# EAGLE design Adafruit TCA9548A (EAGLE 6.4)
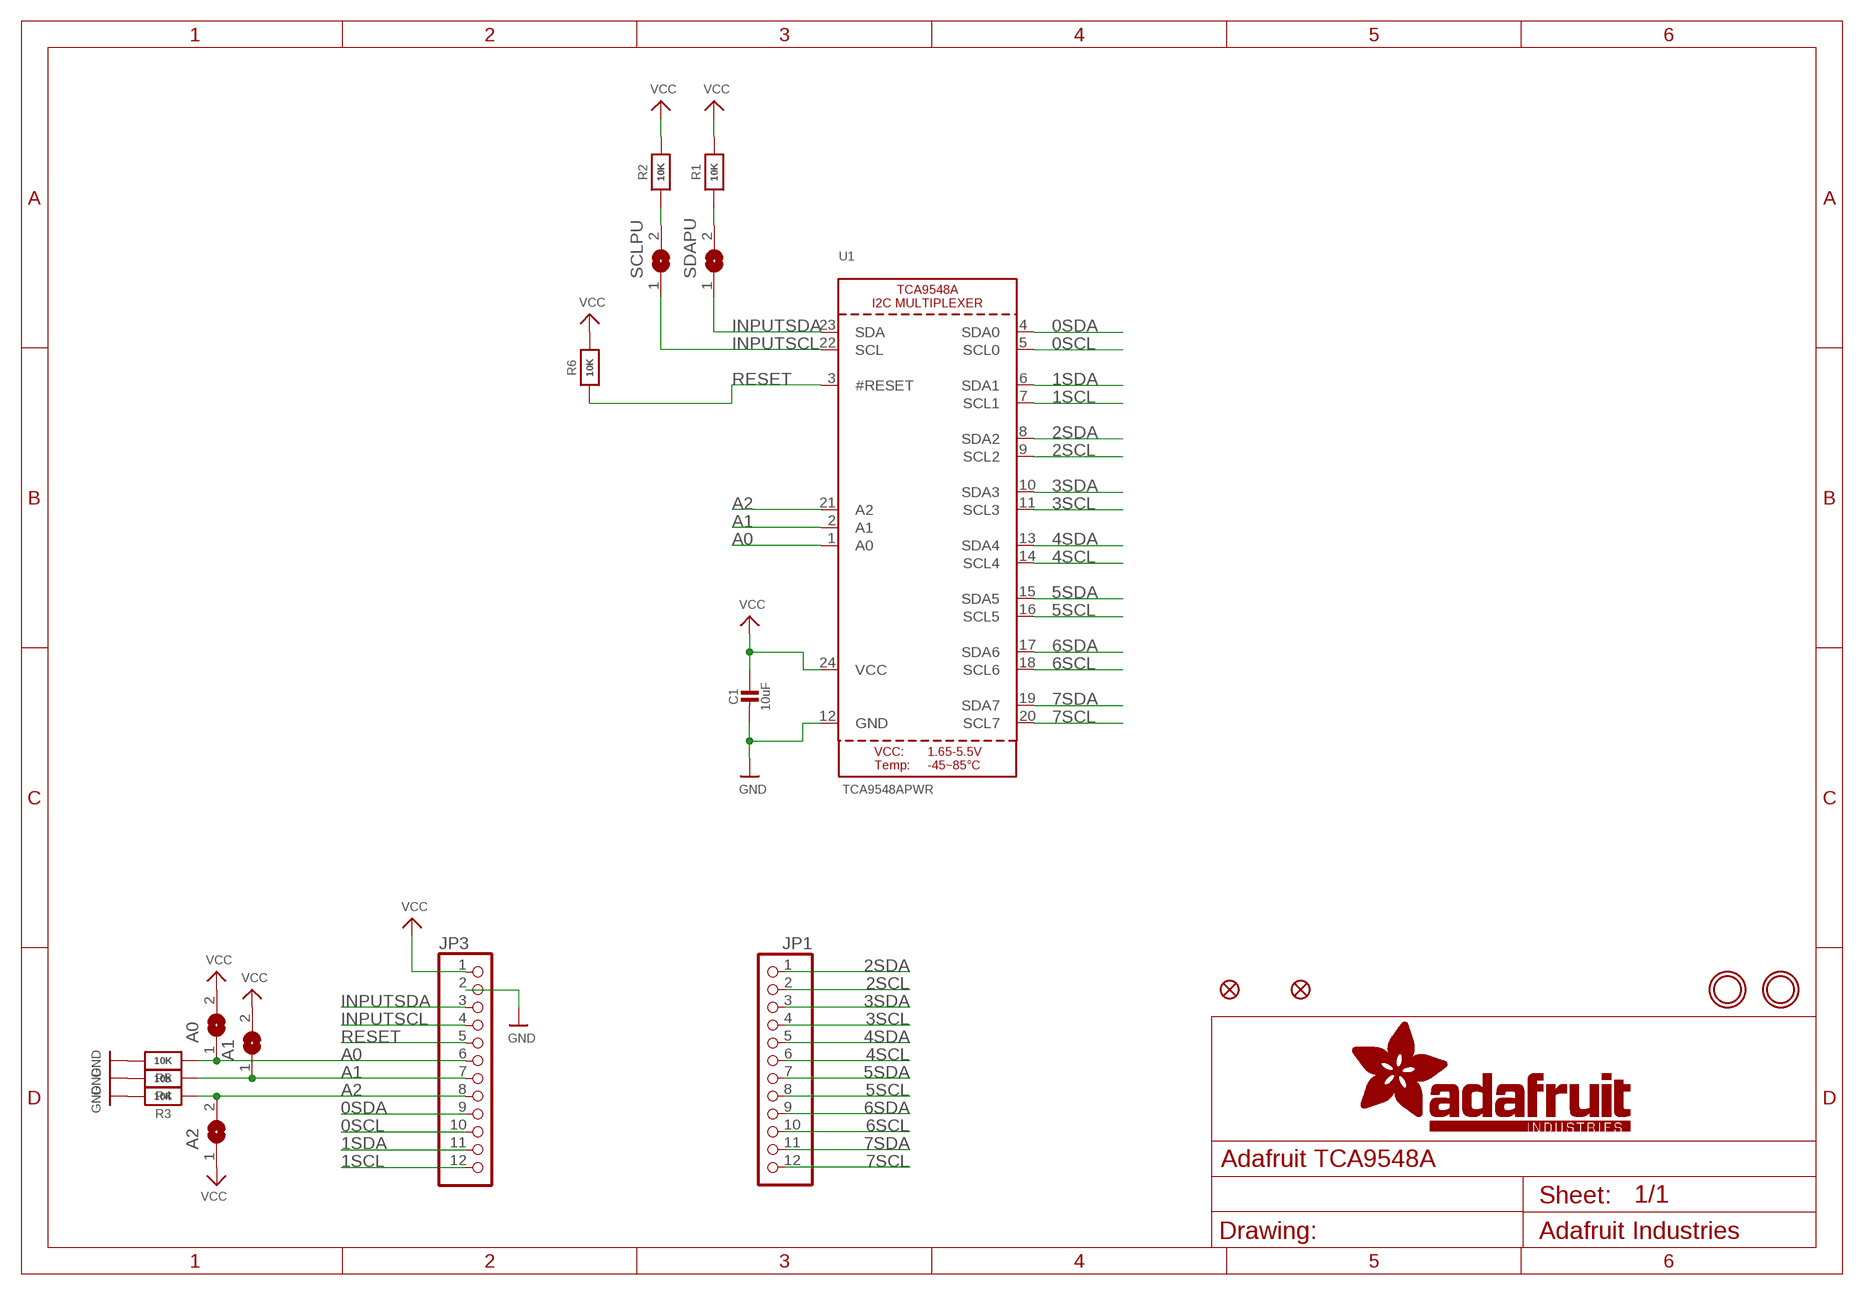
[diagram p0: schematic, sheet 1]

## Parts
A0  SOLDERJUMPER  [SOLDERJUMPER_ARROW_NOPASTE]
A1  SOLDERJUMPER  [SOLDERJUMPER_ARROW_NOPASTE]
A2  SOLDERJUMPER  [SOLDERJUMPER_ARROW_NOPASTE]
C1  10uF  CAP_CERAMIC0805-NOOUTLINE  [0805-NO]
FID1  FIDUCIAL""  [FIDUCIAL_1MM]
FID3  FIDUCIAL""  [FIDUCIAL_1MM]
JP1  HEADER-1X12  [1X12_ROUND]
JP3  HEADER-1X12  [1X12_ROUND]
R1  10K  RESISTOR0805_NOOUTLINE  [0805-NO]
R2  10K  RESISTOR0805_NOOUTLINE  [0805-NO]
R3  10K  RESISTOR0805_NOOUTLINE  [0805-NO]
R4  10K  RESISTOR0805_NOOUTLINE  [0805-NO]
R5  10K  RESISTOR0805_NOOUTLINE  [0805-NO]
R6  10K  RESISTOR_0805MP  [_0805MP]
SCLPU  SOLDERJUMPERCLOSED  [SOLDERJUMPER_CLOSEDWIRE]
SDAPU  SOLDERJUMPERCLOSED  [SOLDERJUMPER_CLOSEDWIRE]
U1  TCA9548APWR  TCA9548A  [TSSOP24]
U$4  MOUNTINGHOLE2.5  [MOUNTINGHOLE_2.5_PLATED]
U$5  MOUNTINGHOLE2.5  [MOUNTINGHOLE_2.5_PLATED]

## Nets
0SCL: JP3.10 U1.5(SCL0)
0SDA: JP3.9 U1.4(SDA0)
1SCL: JP3.12 U1.7(SCL1)
1SDA: JP3.11 U1.6(SDA1)
2SCL: JP1.2 U1.9(SCL2)
2SDA: JP1.1 U1.8(SDA2)
3SCL: JP1.4 U1.11(SCL3)
3SDA: JP1.3 U1.10(SDA3)
4SCL: JP1.6 U1.14(SCL4)
4SDA: JP1.5 U1.13(SDA4)
5SCL: JP1.8 U1.16(SCL5)
5SDA: JP1.7 U1.15(SDA5)
6SCL: JP1.10 U1.18(SCL6)
6SDA: JP1.9 U1.17(SDA6)
7SCL: JP1.12 U1.20(SCL7)
7SDA: JP1.11 U1.19(SDA7)
A0: A0.1 JP3.6 R5.1 U1.1(A0)
A1: A1.1 JP3.7 R4.1 U1.2(A1)
A2: A2.2 JP3.8 R3.1 U1.21(A2)
GND: C1.2 JP3.2 R3.2 R4.2 R5.2 U1.12(GND)
INPUTSCL: JP3.4 SCLPU.1 U1.22(SCL)
INPUTSDA: JP3.3 SDAPU.1 U1.23(SDA)
N$3: R2.1 SCLPU.2
N$4: R1.1 SDAPU.2
RESET: JP3.5 R6.1 U1.3(#RESET)
VCC: A0.2 A1.2 A2.1 C1.1 JP3.1 R1.2 R2.2 R6.2 U1.24(VCC)

## Library data of the parts
A0 A1 A2 = microbuilder:SOLDERJUMPER: SMD Solder JUMPER Solder the two pads together to create a connection, or remove the solder to break it. REFLOW - Use this footprint for solder paste and reflow ovens. WAVE - Use this footprint for hand-soldering (larger pads). CLOSED - Has a trace between the two pads to ensure it is closed by default. The trace needs to be cut to disable the jumper, and can be closed again by creating a solder bridge between the two pads.; BOM: EXCLUDE
C1 = microbuilder:CAP_CERAMIC: Ceramic Capacitors For new designs, use the packages preceded by an '_' character since they are more reliable: The following footprints should be used on most boards: _0402 - Standard footprint for regular board layouts _0603 - Standard footprint for regular board layouts _0805 - Standard footprint for regular board layouts _1206 - Standard footprint for regular board layouts For extremely tight-pitch boards where space is at a premium, the following 'micro-pitch' footprints can be used (smaller pads, no silkscreen outline, etc.): _0402MP - Micro-pitch footprint for very dense/compact boards _0603MP - Micro-pitch footprint for very dense/compact boards _0805MP - Micro-pitch footprint for very dense/compact boards _1206MP - Micro-pitch footprint for very dense/compact boards
FID1 FID3 = microbuilder:FIDUCIAL: Fiducial Alignment Points Various fiducial points for machine vision alignment.; BOM: EXCLUDE
JP1 JP3 = microbuilder:HEADER-1X12
R1-R6 = microbuilder:RESISTOR: Resistors For new designs, use the packages preceded by an '_' character since they are more reliable: The following footprints should be used on most boards: _0402 - Standard footprint for regular board layouts _0603 - Standard footprint for regular board layouts _0805 - Standard footprint for regular board layouts _1206 - Standard footprint for regular board layouts For extremely tight-pitch boards where space is at a premium, the following 'micro-pitch' footprints can be used (smaller pads, no silkscreen outline, etc.): _0402MP - Micro-pitch footprint for very dense/compact boards _0603MP - Micro-pitch footprint for very dense/compact boards _0805MP - Micro-pitch footprint for very dense/compact boards _1206MP - Micro-pitch footprint for very dense/compact boards
SCLPU SDAPU = microbuilder:SOLDERJUMPER: SMD Solder JUMPER Solder the two pads together to create a connection, or remove the solder to break it. REFLOW - Use this footprint for solder paste and reflow ovens. WAVE - Use this footprint for hand-soldering (larger pads). CLOSED - Has a trace between the two pads to ensure it is closed by default. The trace needs to be cut to disable the jumper, and can be closed again by creating a solder bridge between the two pads.
U1 = microbuilder:TCA9548A: TCA9548A I2C Multiplexer
U$4 U$5 = microbuilder:MOUNTINGHOLE: Mounting Hole For #2 screws (0.086"/2.18mm width, 0.094"/2.4mm hole) use 2.5mm; BOM: EXCLUDE

## Board
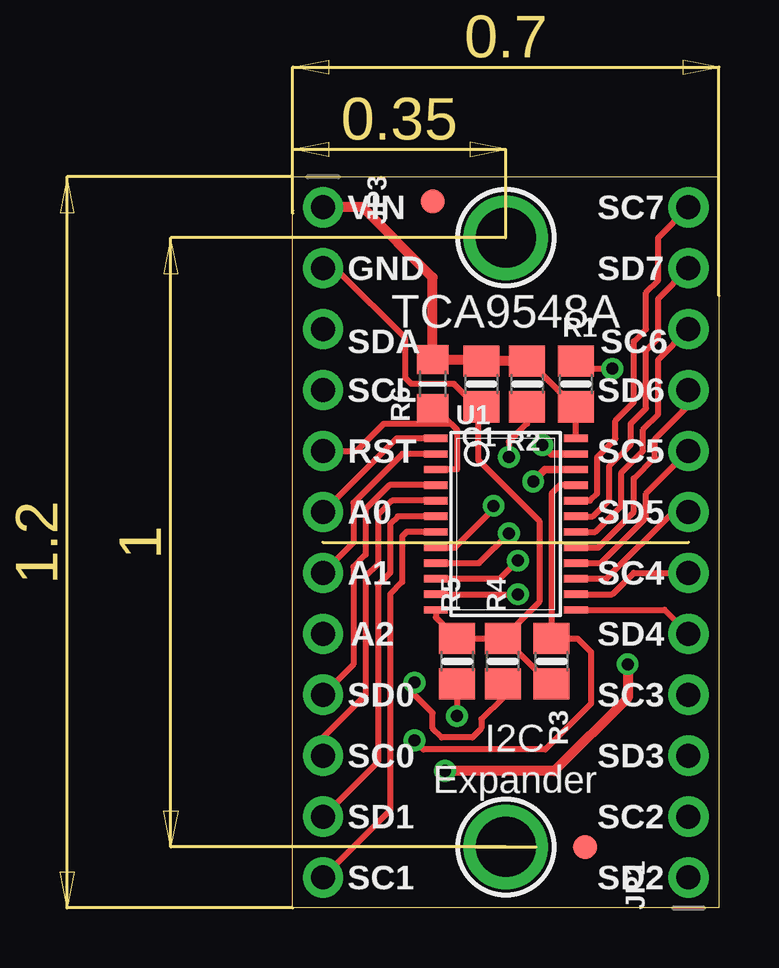
[diagram p1: board, top side]
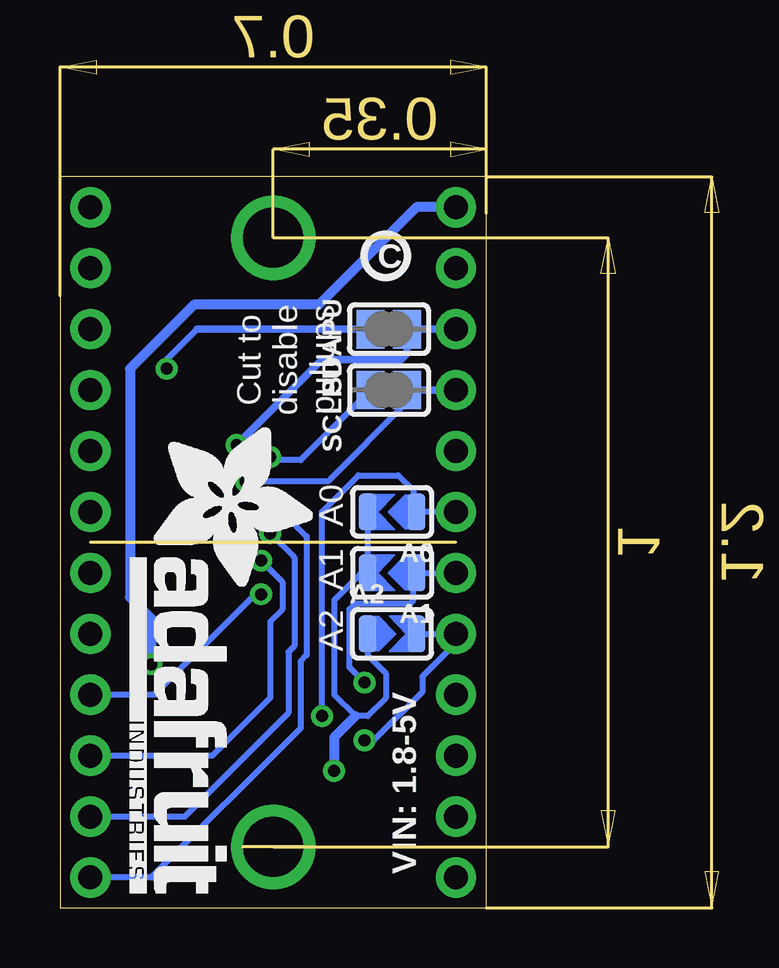
[diagram p2: board, bottom side, seen from below]

Size 17.78 x 30.48 mm. Coordinates in mm from the lower left corner, seen from the top.
Outline: 17.78,0 0,0 0,30.48 17.78,30.48 17.78,0
Copper layers (1*16): Top 0.035mm / dielectric 1.5mm / Bottom 0.035mm
Design rules "adafruit *": minimum track width 8mil, minimum drill 15.5mil, track to track 10mil, track to pad 10mil, pad to pad 10mil, via to via 10mil, smd to smd 8mil, copper to edge 10mil, drill to drill 8mil, minimum pad ring 10mil, minimum via ring 8mil, stop-mask expansion 2mil, vias tented up to drill 20mil, thermal gap 10mil

### Footprints (pad centres in the part's own frame; a part is rotated, then mirrored left to right if it is on the bottom)
SOLDERJUMPER_ARROW_NOPASTE = smd 0.762 x 1.524: 1 -1.016,0; 2 1.016,0
0805-NO = smd 1.3 x 1.5: 1 -0.95,0; 2 0.95,0
FIDUCIAL_1MM = smd 1 x 1: 1 0,0
1X12_ROUND = drill 1 pad 1.676: 1 -13.97,0; 2 -11.43,0; 3 -8.89,0; 4 -6.35,0; 5 -3.81,0; 6 -1.27,0; 7 1.27,0; 8 3.81,0; 9 6.35,0; 10 8.89,0; 11 11.43,0; 12 13.97,0
_0805MP = smd 1.2 x 1.3: 1 -1.016,0; 2 1.016,0
SOLDERJUMPER_CLOSEDWIRE = smd 1.168 x 1.6: 1 -0.762,0; 2 0.762,0 | smd 0.635 x 0.203: WIRE 0,0
TSSOP24 = smd 0.305 x 0.991: 1 -3.575,-2.918; 2 -2.925,-2.918; 3 -2.275,-2.918; 4 -1.625,-2.918; 5 -0.975,-2.918; 6 -0.325,-2.918; 7 0.325,-2.918; 8 0.975,-2.918; 9 1.625,-2.918; 10 2.275,-2.918; 11 2.925,-2.918; 12 3.575,-2.918; 13 3.575,2.918; 14 2.925,2.918; 15 2.275,2.918; 16 1.625,2.918; 17 0.975,2.918; 18 0.325,2.918; 19 -0.325,2.918; 20 -0.975,2.918; 21 -1.625,2.918; 22 -2.275,2.918; 23 -2.925,2.918; 24 -3.575,2.918
MOUNTINGHOLE_2.5_PLATED = drill 2.5 pad 3.2: P$1 0,0

### Placement (x,y rotation side)
A0  3.94,16.51 180 bottom
A1  3.94,13.97 180 bottom
A2  3.94,11.43 0 bottom
C1  7.87,21.84 270 top
FID1  5.84,29.46 0 top
FID3  12.19,2.54 0 top
JP1  16.51,15.24 90 top
JP3  1.27,15.24 270 top
R1  11.81,21.84 270 top
R2  9.78,21.84 90 top
R3  10.79,10.29 270 top
R4  8.76,10.29 90 top
R5  6.86,10.29 90 top
R6  5.84,21.84 90 top
SCLPU  4.06,21.59 180 bottom
SDAPU  4.06,24.13 180 bottom
U1  8.89,16 270 top
U$4  8.89,2.54 0 top
U$5  8.89,27.94 0 top
U$6  [PCBFEAT-REV-040]  4.19,27.18 0 bottom
U$7  [ADAFRUIT_TEXT_20MM]  14.86,20.19 270 bottom

### Tracks (layer width: path | path; a pad name or v marks a point on that pad's centre or on a via)
0SCL
  Top 0.254: U1.5 4.15,16.98 3.56,16.38 3.56,14.35 3.05,13.84 3.05,8.89 1.27,7.11 JP3.10
0SDA
  Top 0.254: U1.4 4.04,17.63 3.05,16.64 3.05,14.73 2.54,14.22 2.54,10.16 JP3.9
1SCL
  Top 0.254: U1.7 4.75,15.68 4.57,15.49 4.57,13.59 4.06,13.08 4.06,4.06 JP3.12
1SDA
  Top 0.254: U1.6 4.39,16.33 4.06,16 4.06,13.97 3.56,13.46 3.56,6.1 JP3.11
2SCL  (via drill 0.5)
  Top 0.254: U1.9 7.77,14.38 v9.02,15.62
  Bottom 0.254: v9.02,15.62 8,14.61 8,10.92 8.26,10.67 8.26,8.13 12.57,3.81 JP1.2
2SDA  (via drill 0.5)
  Top 0.254: U1.8 6.77,15.03 8.38,16.64 v8.38,16.76
  Bottom 0.254: v8.38,16.76 8.38,16.38 7.49,15.49 7.49,10.54 7.75,10.29 7.75,7.49 13.97,1.27 JP1.1
3SCL  (via drill 0.5)
  Top 0.254: U1.11 v9.39,13.08 v9.4,13.08
  Bottom 0.254: v9.4,13.08 9.65,13.08 13.84,8.89 JP1.4
3SDA  (via drill 0.5)
  Top 0.254: U1.10 8.65,13.73 v9.4,14.48
  Bottom 0.254: v9.4,14.48 8.51,13.59 8.51,12.45 9.02,11.94 9.02,8.76 11.43,6.35 JP1.3
4SCL
  Top 0.254: U1.14 13.33,13.08 14.22,13.97 JP1.6
4SDA
  Top 0.254: U1.13 15.51,12.43 JP1.5
5SCL
  Top 0.254: U1.16 12.85,14.38 14.73,16.26 14.73,17.27 JP1.8
5SDA
  Top 0.254: U1.15 13.09,13.73 15.88,16.51 JP1.7
6SCL
  Top 0.254: U1.18 12.63,15.68 13.72,16.76 13.72,18.16 14.61,19.05 14.61,19.94 15.24,20.57 15.24,22.86 JP1.10
6SDA
  Top 0.254: U1.17 12.74,15.03 14.22,16.51 14.22,17.91 15.11,18.8 15.11,19.56 16.51,20.95 JP1.9
7SCL
  Top 0.254: U1.20 12.4,16.98 12.7,17.27 12.7,18.8 13.46,19.56 13.46,20.32 14.22,21.08 14.22,23.62 14.73,24.13 14.73,25.65 15.24,26.16 15.24,27.94 JP1.12
7SDA
  Top 0.254: U1.19 12.52,16.33 13.21,17.02 13.21,18.41 14.1,19.3 14.1,20.19 14.73,20.83 14.73,23.24 15.24,23.75 15.24,25.4 JP1.11
A0  (via drill 0.5)
  Top 0.254: U1.1 4.34,19.58 JP3.6 | R5.1 v6.86,8
  Bottom 0.254: JP3.6 A0.1 3.05,16.64 3.05,17.4 3.68,18.03 5.33,18.03 6.86,16.51 v6.86,8
A1  (via drill 0.5)
  Top 0.254: U1.2 4.58,18.93 2.54,16.89 2.54,15.24 JP3.7 | R4.1 8.76,8.76 7.87,7.87 7.87,7.49 7.49,7.11 6.22,7.11 5.84,7.49 5.84,8.13 5.08,8.89 v5.08,9.4
  Bottom 0.254: JP3.7 A1.1 3.05,13.84 3.05,12.83 3.17,12.7 5.46,12.7 5.71,12.45 5.71,10.03 v5.08,9.4
A2  (via drill 0.5)
  Top 0.254: U1.21 11.15,17.63 10.79,17.27 R3.1 11.88,11.24 12.45,10.67 12.45,8.51 10.54,6.6 5.46,6.6 v5.08,6.99
  Bottom 0.254: A2.2 JP3.8 1.27,11.05 2.67,9.65 2.67,9.02 4.7,6.99 v5.08,6.99
GND
  Top 0.254: U1.12 5.97,12.12 R5.2 R4.2 | R4.2 8.83,11.24 10.73,9.34 R3.2 | R4.2 10.29,12.76 10.29,16.13 7.75,18.67 7.75,20.83 | 7.75,20.83 6.73,21.84 4.95,21.84 4.7,22.1 4.7,23.75 1.91,26.54 1.4,26.54 JP3.2 | 7.75,20.83 7.81,20.83 C1.2
INPUTSCL  (via drill 0.5)
  Top 0.305: U1.22 10.53,18.28 v10.03,17.78
  Bottom 0.254: SCLPU.1 3.3,21.08 6.6,17.78 v10.03,17.78
  Bottom 0.305: SCLPU.1 JP3.4
INPUTSDA  (via drill 0.5)
  Top 0.305: U1.23 10.79,18.93 v10.41,19.3
  Bottom 0.305: JP3.3 SDAPU.1 3.3,23.11 3.56,22.86 6.86,22.86 v10.41,19.3
N$3  (via drill 0.5)
  Top 0.254: R2.1 9.78,20.19 9.02,19.43 v9.02,18.8
  Bottom 0.254: v9.02,18.8 8.89,18.67 7.75,18.67 SCLPU.2
N$4  (via drill 0.5)
  Top 0.254: R1.1 12.13,22.48 v13.34,22.48
  Bottom 0.254: 12.06,24.13 13.34,22.86 v13.34,22.48
  Bottom 0.305: SDAPU.2 12.06,24.13
RESET
  Top 0.254: JP3.5 2.67,19.05 3.81,20.19 6.6,20.19 | 6.6,20.19 6.86,19.94 6.86,18.29 5.98,18.29 U1.3 | 6.6,20.19 6.03,20.77 5.9,20.77 R6.1
VCC  (via drill 0.5)
  Top 0.254: 7.81,22.86 C1.1 | R2.2 9.85,22.79 11.74,20.89 R1.2 | R1.2 | U1.24 R1.2
  Top 0.305: U1.24 11.66,19.58
  Top 0.406: JP3.1 2.92,29.21 5.84,26.29 R6.2 7.81,22.86 | v13.97,10.16 13.97,8.76 10.92,5.71 v6.35,5.71 | R2.2 C1.1
  Bottom 0.254: A0.2 A1.2 5.21,13.97 6.35,12.83 6.35,8.89 5.46,8 4.95,8 4.19,8.76 4.19,9.78 4.95,10.54 A2.1 | v6.35,5.71 6.35,5.59
  Bottom 0.406: v6.35,5.71 6.35,7.11 5.46,8 | JP3.1 2.92,29.21 6.99,25.15 12.19,25.15 14.86,22.48 14.86,12.95 13.97,12.06 v13.97,10.16

### Text on the board
tPlace: VIN | SC7 | GND | SD7 | TCA9548A | SDA | SC6 | SCL | SD6 | RST | SC5 | A0 | SD5 | A1 | SC4 | A2 | SD4 | SD0 | SC3 | SC0 | I2C / Expander | SD3 | SD1 | SC2 | SC1 | SD2
bPlace: Cut to / disable / pullups | A0 | A1 | A2 | VIN: 1.8-5V